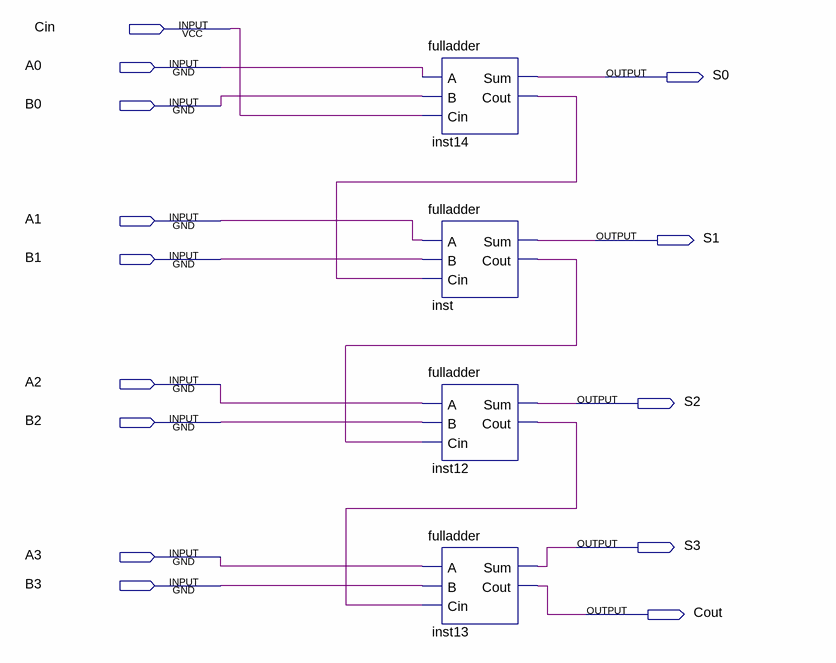
[diagram p0: schematic sheet]
// Quartus schematic 4bitFullAdder.bdf as structural Verilog: 4 symbols, 14 pins
module \4bitFullAdder  (
  input  Cin,
  input  A0,
  input  B0,
  input  A1,
  input  B1,
  input  A2,
  input  B2,
  input  A3,
  input  B3,
  output S0,
  output S1,
  output S2,
  output S3,
  output Cout
);

  wire inst12_cout, inst14_cout, inst_cout;

  fulladder inst14 (.A(A0), .B(B0), .Cin(Cin), .Sum(S0), .Cout(inst14_cout));
  fulladder inst (.A(A1), .B(B1), .Cin(inst14_cout), .Sum(S1), .Cout(inst_cout));
  fulladder inst12 (.A(A2), .B(B2), .Cin(inst_cout), .Sum(S2), .Cout(inst12_cout));
  fulladder inst13 (.A(A3), .B(B3), .Cin(inst12_cout), .Sum(S3), .Cout(Cout));
endmodule
